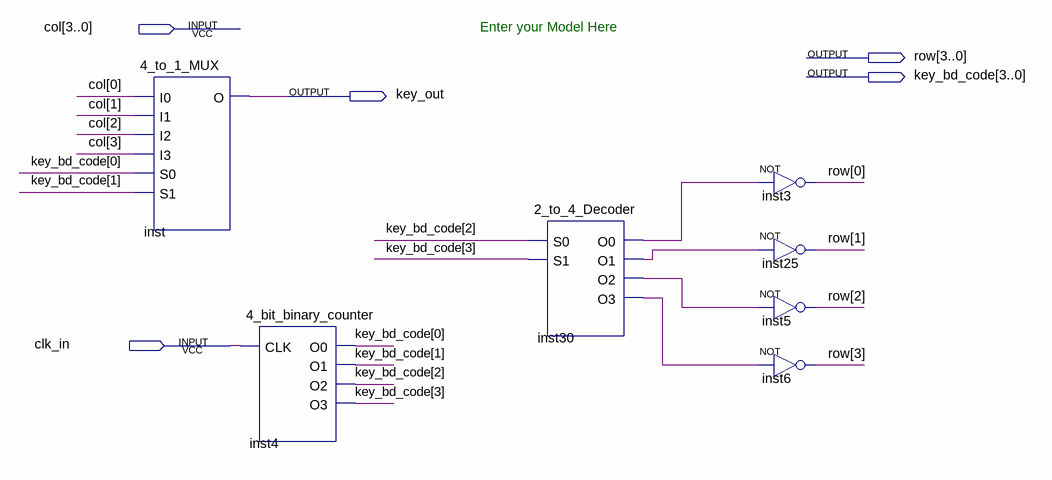
[diagram p0: schematic sheet]
// Quartus schematic key_scan.bdf as structural Verilog: 7 symbols, 5 pins
module key_scan (
  input  [3:0] col,
  input  clk_in,
  output [3:0] row,
  output [3:0] key_bd_code,
  output key_out
);

  wire inst30_o0, inst30_o1, inst30_o2, inst30_o3;

  \4_to_1_MUX  inst (
    .I0(col[0]), .I1(col[1]), .I2(col[2]), .I3(col[3]), .S0(key_bd_code[0]), .S1(key_bd_code[1]), .O(key_out));
  \4_bit_binary_counter  inst4 (
    .CLK(clk_in), .O0(key_bd_code[0]), .O1(key_bd_code[1]), .O2(key_bd_code[2]), .O3(key_bd_code[3]));
  \2_to_4_Decoder  inst30 (
    .S0(key_bd_code[2]), .S1(key_bd_code[3]), .O0(inst30_o0), .O1(inst30_o1), .O2(inst30_o2), .O3(inst30_o3));
  not inst3 (row[0], inst30_o0);
  not inst25 (row[1], inst30_o1);
  not inst5 (row[2], inst30_o2);
  not inst6 (row[3], inst30_o3);

  // Notes on the sheet:
  //   Enter your Model Here
endmodule
